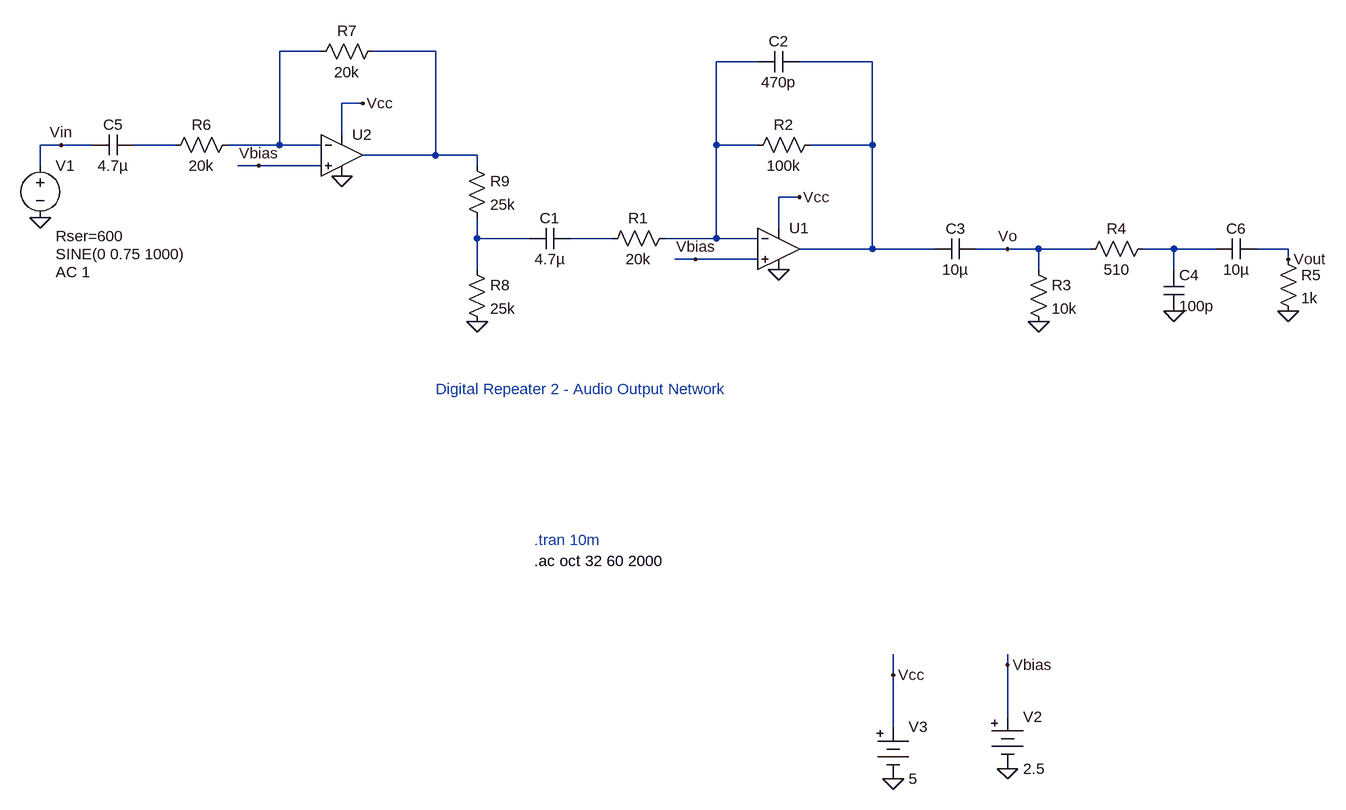
[diagram p0: schematic out2.asc]
out2.asc, the LTspice schematic file:
Version 4
SHEET 1 1352 968
WIRE -400 -176 -464 -176
WIRE -224 -176 -320 -176
WIRE 272 -160 208 -160
WIRE 448 -160 336 -160
WIRE -336 -96 -368 -96
WIRE -368 -48 -368 -96
WIRE -800 -32 -832 -32
WIRE -752 -32 -800 -32
WIRE -624 -32 -688 -32
WIRE -464 -32 -464 -176
WIRE -464 -32 -544 -32
WIRE -400 -32 -464 -32
WIRE 208 -32 208 -160
WIRE 272 -32 208 -32
WIRE 448 -32 448 -160
WIRE 448 -32 352 -32
WIRE -224 -16 -224 -176
WIRE -224 -16 -336 -16
WIRE -160 -16 -224 -16
WIRE -832 0 -832 -32
WIRE -496 0 -528 0
WIRE -400 0 -496 0
WIRE -160 0 -160 -16
WIRE 336 48 304 48
WIRE 304 96 304 48
WIRE -160 112 -160 80
WIRE -80 112 -160 112
WIRE 48 112 -16 112
WIRE 208 112 208 -32
WIRE 208 112 128 112
WIRE 272 112 208 112
WIRE 448 128 448 -32
WIRE 448 128 336 128
WIRE 544 128 448 128
WIRE 656 128 608 128
WIRE 704 128 656 128
WIRE 784 128 704 128
WIRE 912 128 864 128
WIRE 976 128 912 128
WIRE 1088 128 1040 128
WIRE 176 144 144 144
WIRE 272 144 176 144
WIRE 1088 144 1088 128
WIRE -160 160 -160 112
WIRE 704 160 704 128
WIRE 912 160 912 128
WIRE 656 768 656 752
WIRE 480 784 480 752
WIRE 656 848 656 768
WIRE 480 864 480 784
FLAG 656 928 0
FLAG -832 80 0
FLAG 704 240 0
FLAG 912 224 0
FLAG 1088 224 0
FLAG 304 160 0
FLAG 480 944 0
FLAG 1088 144 Vout
FLAG -800 -32 Vin
FLAG 176 144 Vbias
FLAG 656 768 Vbias
FLAG 480 784 Vcc
FLAG 336 48 Vcc
FLAG 656 128 Vo
FLAG -368 16 0
FLAG -496 0 Vbias
FLAG -336 -96 Vcc
FLAG -160 240 0
SYMBOL voltage -832 -16 R0
WINDOW 3 24 152 Left 2
WINDOW 123 24 180 Left 2
WINDOW 39 24 124 Left 2
SYMATTR Value SINE(0 0.75 1000)
SYMATTR Value2 AC 1
SYMATTR SpiceLine Rser=600
SYMATTR InstName V1
SYMBOL Misc\\battery 656 832 R0
WINDOW 123 0 0 Left 0
WINDOW 39 0 0 Left 0
SYMATTR InstName V2
SYMATTR Value 2.5
SYMBOL res 144 96 R90
WINDOW 0 0 56 VBottom 2
WINDOW 3 32 56 VTop 2
SYMATTR InstName R1
SYMATTR Value 20k
SYMBOL cap -16 96 R90
WINDOW 0 0 32 VBottom 2
WINDOW 3 32 32 VTop 2
SYMATTR InstName C1
SYMATTR Value 4.7µ
SYMBOL res 368 -48 R90
WINDOW 0 0 56 VBottom 2
WINDOW 3 32 56 VTop 2
SYMATTR InstName R2
SYMATTR Value 100k
SYMBOL cap 336 -176 R90
WINDOW 0 0 32 VBottom 2
WINDOW 3 32 32 VTop 2
SYMATTR InstName C2
SYMATTR Value 470p
SYMBOL cap 608 112 R90
WINDOW 0 0 32 VBottom 2
WINDOW 3 32 32 VTop 2
SYMATTR InstName C3
SYMATTR Value 10µ
SYMBOL res 688 144 R0
SYMATTR InstName R3
SYMATTR Value 10k
SYMBOL res 880 112 R90
WINDOW 0 0 56 VBottom 2
WINDOW 3 32 56 VTop 2
SYMATTR InstName R4
SYMATTR Value 510
SYMBOL cap 896 160 R0
SYMATTR InstName C4
SYMATTR Value 100p
SYMBOL res 1072 128 R0
SYMATTR InstName R5
SYMATTR Value 1k
SYMBOL Misc\\battery 480 848 R0
WINDOW 123 0 0 Left 0
WINDOW 39 0 0 Left 0
SYMATTR InstName V3
SYMATTR Value 5
SYMBOL OpAmps\\UniversalOpAmp 304 128 R0
SYMATTR InstName U1
SYMBOL res -528 -48 R90
WINDOW 0 0 56 VBottom 2
WINDOW 3 32 56 VTop 2
SYMATTR InstName R6
SYMATTR Value 20k
SYMBOL cap -688 -48 R90
WINDOW 0 0 32 VBottom 2
WINDOW 3 32 32 VTop 2
SYMATTR InstName C5
SYMATTR Value 4.7µ
SYMBOL res -304 -192 R90
WINDOW 0 0 56 VBottom 2
WINDOW 3 32 56 VTop 2
SYMATTR InstName R7
SYMATTR Value 20k
SYMBOL OpAmps\\UniversalOpAmp -368 -16 R0
SYMATTR InstName U2
SYMBOL res -176 144 R0
SYMATTR InstName R8
SYMATTR Value 25k
SYMBOL res -176 -16 R0
SYMATTR InstName R9
SYMATTR Value 25k
SYMBOL cap 1040 112 R90
WINDOW 0 0 32 VBottom 2
WINDOW 3 32 32 VTop 2
SYMATTR InstName C6
SYMATTR Value 10µ
TEXT -72 576 Left 2 ;.tran 10m
TEXT -72 608 Left 2 !.ac oct 32 60 2000
TEXT -224 344 Left 2 ;Digital Repeater 2 - Audio Output Network

The netlist it stands for:
* out2.asc
V1 Vin 0 SINE(0 0.75 1000) AC 1 Rser=600
V2 Vbias 0 2.5
R1 N003 N007 20k
C1 N007 N006 4.7µ
R2 N004 N003 100k
C2 N004 N003 470p
C3 Vo N004 10µ
R3 Vo 0 10k
R4 N008 Vo 510
C4 N008 0 100p
R5 Vout 0 1k
V3 Vcc 0 5
XU1 Vbias N003 Vcc 0 N004 level1 Avol=1Meg GBW=10Meg Vos=0 En=0 Enk=0 In=0 Ink=0 Rin=500Meg  ; pins In+ In- V+ V- OUT
R6 N001 N005 20k
C5 N005 Vin 4.7µ
R7 N002 N001 20k
XU2 Vbias N001 Vcc 0 N002 level1 Avol=1Meg GBW=10Meg Vos=0 En=0 Enk=0 In=0 Ink=0 Rin=500Meg  ; pins In+ In- V+ V- OUT
R8 N006 0 25k
R9 N002 N006 25k
C6 Vout N008 10µ
* .tran 10m
.ac oct 32 60 2000
* Digital Repeater 2 - Audio Output Network
.lib UniversalOpAmp1.lib
.backanno
.end